# EasyEDA Pro project ProProject_stm32f103c8t6最小系统板_2024-05-02.epro

# Schematic Schematic1
Create Date: 2023-10-04; Page Name: P1; Project Name: stm32f103c8t6最小系统板; Schematic Name: Schematic1; Update Date: 2023-10-05; Company: 嘉立创EDA; Page Size: A4; Version: V1.0
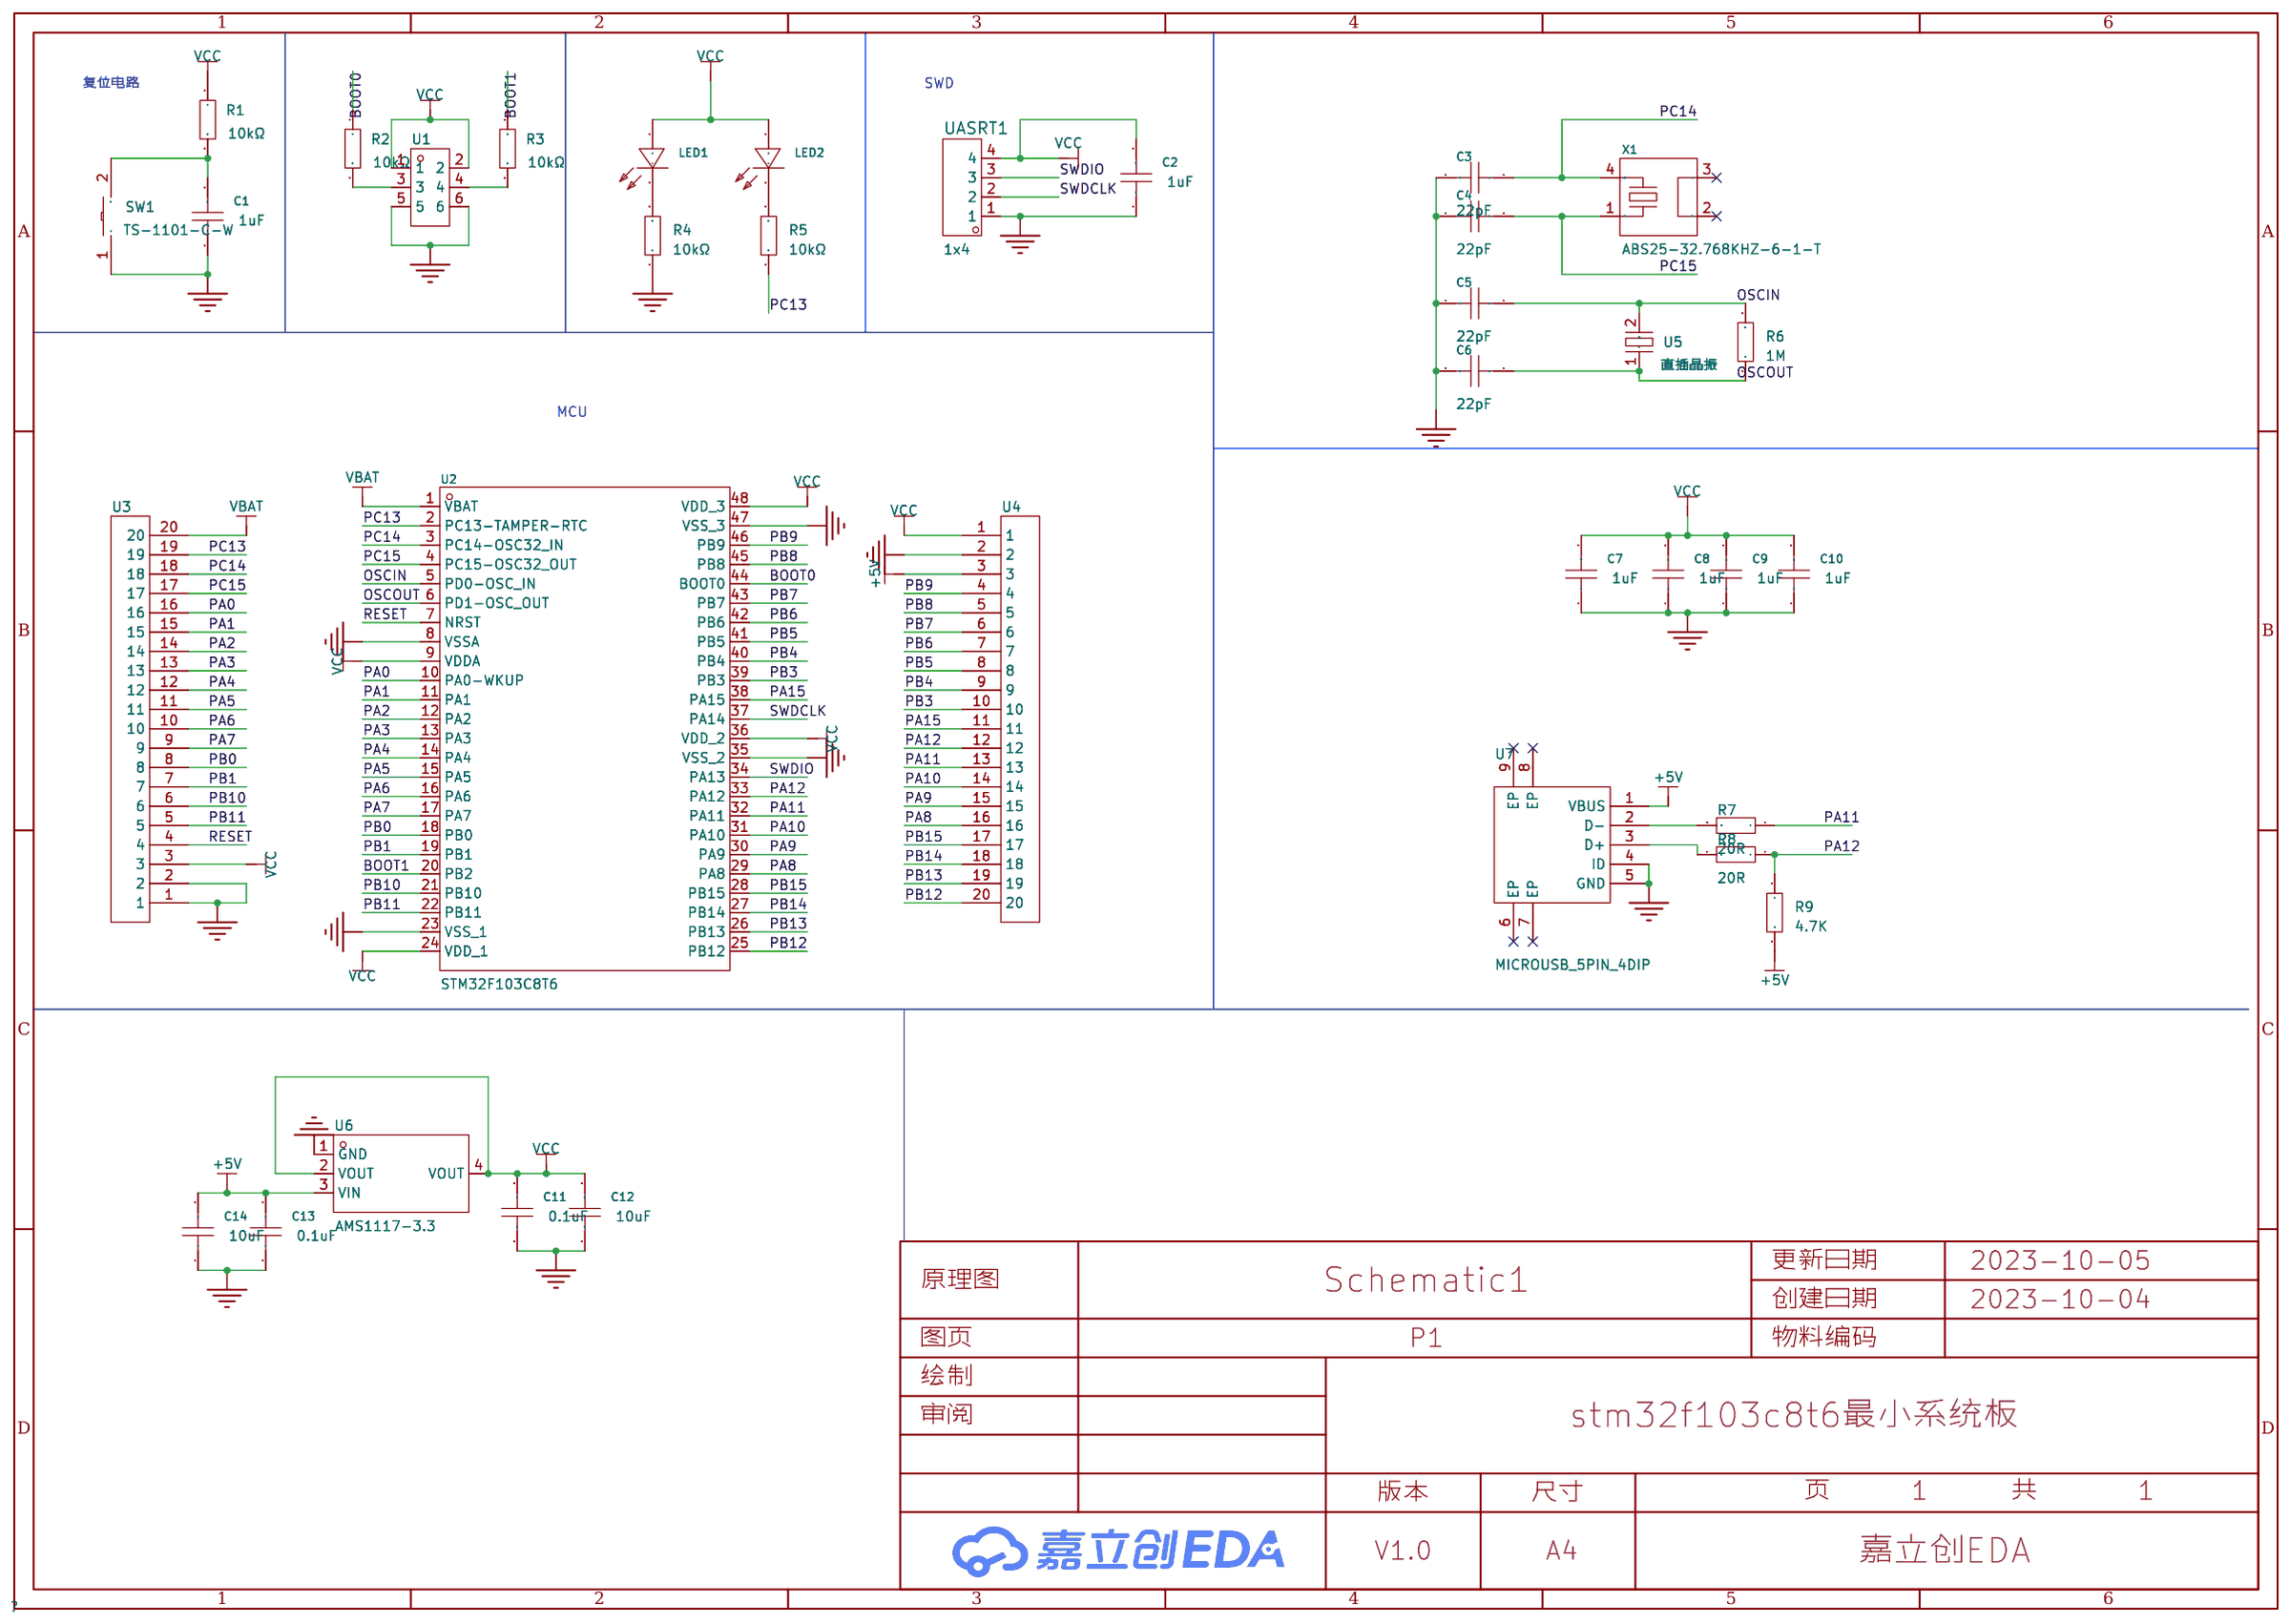
[diagram p0: schematic sheet]

## Parts
C1  1uF  [C0603]
C2  1uF  [C0603]
C3  22pF  [C0603]
C4  22pF  [C0603]
C5  22pF  [C0603]
C6  22pF  [C0603]
C7  1uF  [C0603]
C8  1uF  [C0603]
C9  1uF  [C0603]
C10  1uF  [C0603]
C11  0.1uF  [C0603]
C12  10uF  [C0603]
C13  0.1uF  [C0603]
C14  10uF  [C0603]
LED1  KT-0805G  [LED0805-R-RD]
LED2  KT-0805G  [LED0805-R-RD]
R1  10kΩ  [R0603]
R2  10kΩ  [R0603]
R3  10kΩ  [R0603]
R4  10kΩ  [R0603]
R5  10kΩ  [R0603]
R6  1M  [R0603]
R7  20R  [R0603]
R8  20R  [R0603]
R9  4.7K  [R0603]
SW1  TS-1101-C-W  [SW-SMD_L6.0-W3.3-LS8.0]
U1  2.54mm,2X3,短针针长3mm,长针针长6mm  [HDR-TH_6P-P2.54-V-M-R2-C3-S2.54-2]
U2  STM32F103C8T6  [LQFP-48_L7.0-W7.0-P0.50-LS9.0-BL]
U3  -  [HDR1X20]
U4  -  [HDR1X20]
U5  直插晶振  [HC-49S_L11.0-W4.7-P4.88]
U6  AMS1117-3.3  [SOT-223-3_L6.5-W3.4-P2.30-LS7.0-BR]
U7  MICROUSB_5PIN_4DIP  [MICRO-USB-SMD_U254-051N-4BH806]
UASRT1  1x4  [HDR-TH_4P-P2.54-V-M-1]
X1  ABS25-32.768KHZ-6-1-T  [SOJ-4_L8.4-W3.8-P5.5-BL]

## Library data of the parts
C1-C14 = TCC0603X5R475K250CT: 容值:4.7uF;额定电压:25V;材质(温度系数):X5R;; LCSC Part Name: 4.7uF 25V; Supplier Part: C5360844; Manufacturer: CCTC(三环); Supplier Footprint: 0603; Datasheet: https://atta.szlcsc.com/upload/public/pdf/source/20191203/C466239_F62A586702D44EEA1C39B32FC8662B21.pdf; Supplier: LCSC; Voltage Rated: 25V; Temperature Coefficient: X5R
LED1 LED2 = KT-0805G: 发光颜色:翠绿;二极管配置:-;透镜颜色:-;主波长:-;色温:-;光通量(25℃时):-;发光强度:-;功率:-;发光角度:-;安装方式:-;工作温度:-;; LCSC Part Name: 0805 翠绿 高亮; Supplier Part: C2297; Manufacturer: KENTO; Supplier Footprint: 0805; JLCPCB Part Class: 基础库; Datasheet: https://atta.szlcsc.com/upload/public/pdf/source/20170209/1486607340485.pdf; Supplier: LCSC; Emitted Color: 翠绿
R1-R9 = 0603WAF1002T5E: 电阻类型:厚膜电阻;阻值:10kΩ;精度:±1%;功率:100mW;; LCSC Part Name: 厚膜电阻 10kΩ ±1% 100mW; Supplier Part: C25804; Manufacturer: UNI-ROYAL(厚声); Supplier Footprint: 0603; JLCPCB Part Class: 基础库; Datasheet: https://atta.szlcsc.com/upload/public/pdf/source/20200306/C422600_1E6D84923E4A46A82E41ADD87F860B5C.pdf; Supplier: LCSC; Type: 厚膜电阻; Tolerance: ±1%; Power(Watts): 100mW; Temperature Coefficient: ±100ppm/℃; Overload Voltage (Max): 75V; Operating Temperature Range: -55℃~+155℃
SW1 = TS-1101-C-W: 触点电流:50mA;额定电压(AC):-;额定电压(DC):12V;额定功率:-;绝缘电阻:-;电路结构:单刀单掷;安装方式:立贴;带灯:无;作用力:260gf;机械寿命:5万次;带支架:否;; LCSC Part Name: 立贴 6*3.6*2.5mm 轻触开关 一型3*6*2.5有白ZD b拉伸白色带淡绿按键 卷装; Supplier Part: C318938; Manufacturer: XKB Connectivity(中国星坤); Supplier Footprint: SMD; JLCPCB Part Class: 扩展库; Datasheet: https://atta.szlcsc.com/upload/public/pdf/source/20200227/C318938_C2E53B1EEDE37D980A33616AC086DE53.pdf; Supplier: LCSC; Contact Current: 50mA; Voltage Rating (DC): 12V; Circuit: 单刀单掷; Mounting Style: 立贴; Actuator Style: 矩形按钮; Actuator/Cap Color: 白色带淡绿; With Lamp: 无; Operating Force: 260gf; Mechanical Life: 5万次; Operating Temperature: -30℃~+85℃; Switch Length: 6mm; Switch Width: 3.6mm; Switch Height: 2.5mm; Strike Gundam: 否
U1 = 2.54mm,2X3,短针针长3mm,长针针长6mm: Supplier Part: C9900024418; Supplier Footprint: 2X3; JLCPCB Part Class: 扩展库; Supplier: LCSC
U2 = STM32F103C8T6: CPU内核:ARM Cortex-M3;CPU最大主频:72MHz;工作电压范围:2V~3.6V;内部振荡器:有;程序 FLASH容量:64K@x8bit;RAM总容量:20KB;EEPROM/数据 FLASH容量:-;GPIO端口数量:37;ADC(单元数/通道数/位数):1@x10ch/12bit;外设/功能/协议栈:看门狗；DMA；看门狗；片载温度传感器;工作温度范围:-40℃~+85℃;; LCSC Part Name: ARM Cortex-M3 72MHz 闪存：64K@x8bit RAM：20KB MSL=3; Supplier Part: C8734; Manufacturer: ST(意法半导体); Supplier Footprint: LQFP-48(7x7); JLCPCB Part Class: 扩展库; Supplier: LCSC; CPU Core: ARM Cortex-M3; Maximum Frequency: 72MHz; Supply Voltage Range: 2V~3.6V; Internal Oscillator: 有; Program FLASH Size: 64K@x8bit; RAM Size: 20KB; GPIO Ports Number: 37; ADC (Units/Channels/bits): 1@x10ch/12bit; Peripherals / Functions / Protocol Stacks: 看门狗；DMA；看门狗；片载温度传感器; Operating Temperature Range: -40℃~+85℃
U3 U4 = 1X20
U5 = 直插晶振: Supplier Part: C9900021663; Supplier Footprint: 直插HC-49S; JLCPCB Part Class: 扩展库; Datasheet: https://atta.szlcsc.comnull; Supplier: LCSC
U6 = AMS1117-3.3_C6186: 输出类型:固定;输出极性:正;最大输入电压:-;输出电压:3.3V;输出电流:1A;电源纹波抑制比(PSRR):72dB@(120Hz);; LCSC Part Name: 输出3.3V 1A; Supplier Part: C6186; Manufacturer: AMS; Supplier Footprint: SOT-223; JLCPCB Part Class: 基础库; Datasheet: https://atta.szlcsc.com/upload/public/pdf/source/20180727/C6186_7A095716F0823C02F1997A905E26C086.pdf; Supplier: LCSC; Output Type: 固定; Output Polarity: 正; Number of Outputs: 1; Output Voltage: 3.3V; Dropout Voltage: 1.3V@(800mA); Output Current: 1A; Power Supply Rejection Ratio (PSRR): 72dB@(120Hz)
U7 = MICROUSB_5PIN_4DIP: Supplier Part: C9900010529; Supplier Footprint: USB_JACK; JLCPCB Part Class: 扩展库; Datasheet: https://atta.szlcsc.comnull; Supplier: LCSC
UASRT1 = 1x4: Supplier: LCSC; Manufacturer: ReliaPro; Manufacturer Part: Headers  Pins 1*4P; Supplier Part: C59481; JLCPCB Part Class: 扩展库
X1 = ABS25-32.768KHZ-6-1-T: Supplier Part: C5369037; Manufacturer: ABRACON; Supplier Footprint: SMD,3.8x8.4mm; JLCPCB Part Class: 扩展库; Datasheet: https://atta.szlcsc.com/upload/public/pdf/source/20210430/52A88B33D8D8DD9FFF4B1335EB6510DA.pdf; Supplier: LCSC

## Nets
+5V: C13.2 C14.2 R9.2 U4.3 U6.3(VIN) U7.1(VBUS)
GND: C1.1 C2.1 C3.2 C4.2 C5.2 C6.2 C7.1 C8.1 C9.1 C10.1 C11.1 C12.1 C13.1 C14.1 R4.1 SW1.1 U1.5 U1.6 U2.8(VSSA) U2.23(VSS_1) U2.35(VSS_2) U2.47(VSS_3) U3.1 U3.2 U4.2 U6.1(GND) U7.4(ID) U7.5(GND) UASRT1.1
VBAT: U2.1(VBAT) U3.20
VCC: C2.2 C7.2 C8.2 C9.2 C10.2 C11.2 C12.2 LED1.1(A) LED2.1(A) R1.1 U1.1 U1.2 U2.9(VDDA) U2.24(VDD_1) U2.36(VDD_2) U2.48(VDD_3) U3.3 U4.1 U6.2(VOUT) U6.4(VOUT) UASRT1.4
BOOT0: R2.1 U2.44(BOOT0)
BOOT1: R3.1 U2.20(PB2)
OSCIN: C5.1 R6.2 U2.5(PD0-OSC_IN) U5.2(GND)
OSCOUT: C6.1 R6.1 U2.6(PD1-OSC_OUT) U5.1
PA0: U2.10(PA0-WKUP) U3.16
PA1: U2.11(PA1) U3.15
PA2: U2.12(PA2) U3.14
PA3: U2.13(PA3) U3.13
PA4: U2.14(PA4) U3.12
PA5: U2.15(PA5) U3.11
PA6: U2.16(PA6) U3.10
PA7: U2.17(PA7) U3.9
PA8: U2.29(PA8) U4.16
PA9: U2.30(PA9) U4.15
PA10: U2.31(PA10) U4.14
PA11: R7.1 U2.32(PA11) U4.13
PA12: R8.1 R9.1 U2.33(PA12) U4.12
PA15: U2.38(PA15) U4.11
PB0: U2.18(PB0) U3.8
PB1: U2.19(PB1) U3.7
PB3: U2.39(PB3) U4.10
PB4: U2.40(PB4) U4.9
PB5: U2.41(PB5) U4.8
PB6: U2.42(PB6) U4.7
PB7: U2.43(PB7) U4.6
PB8: U2.45(PB8) U4.5
PB9: U2.46(PB9) U4.4
PB10: U2.21(PB10) U3.6
PB11: U2.22(PB11) U3.5
PB12: U2.25(PB12) U4.20
PB13: U2.26(PB13) U4.19
PB14: U2.27(PB14) U4.18
PB15: U2.28(PB15) U4.17
PC13: R5.1 U2.2(PC13-TAMPER-RTC) U3.19
PC14: C3.1 U2.3(PC14-OSC32_IN) U3.18 X1.4(GND)
PC15: C4.1 U2.4(PC15-OSC32_OUT) U3.17 X1.1
RESET: U2.7(NRST) U3.4
SWDCLK: U2.37(PA14) UASRT1.2
SWDIO: U2.34(PA13) UASRT1.3
$1N292: C1.2 R1.2 SW1.2
$1N842: R2.2 U1.3
$1N848: R3.2 U1.4
$1N1286: LED1.2(K) R4.2
$1N1428: LED2.2(K) R5.2
$1N8117: R7.2 U7.2(D-)
$1N8148: R8.2 U7.3(D+)

Not connected (* = marked no-connect by the designer): U7 6(EP)* 7(EP)* 8(EP)* 9(EP)*; X1 2(GND)* 3*

## Notes on the sheet
- 复位电路
- SWD
- MCU

# Board PCB1
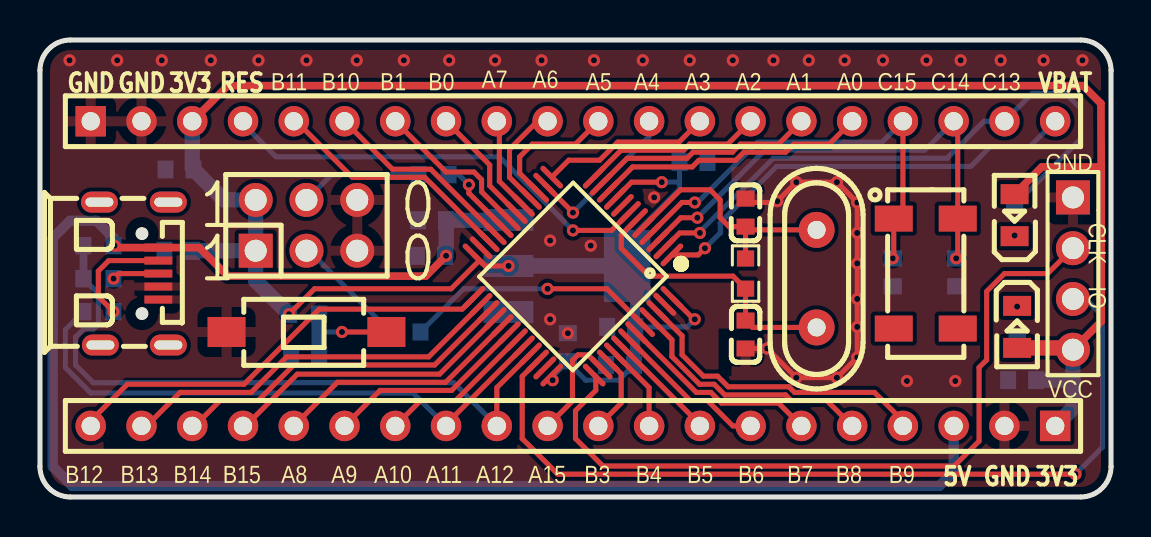
[diagram p1: board, top side]
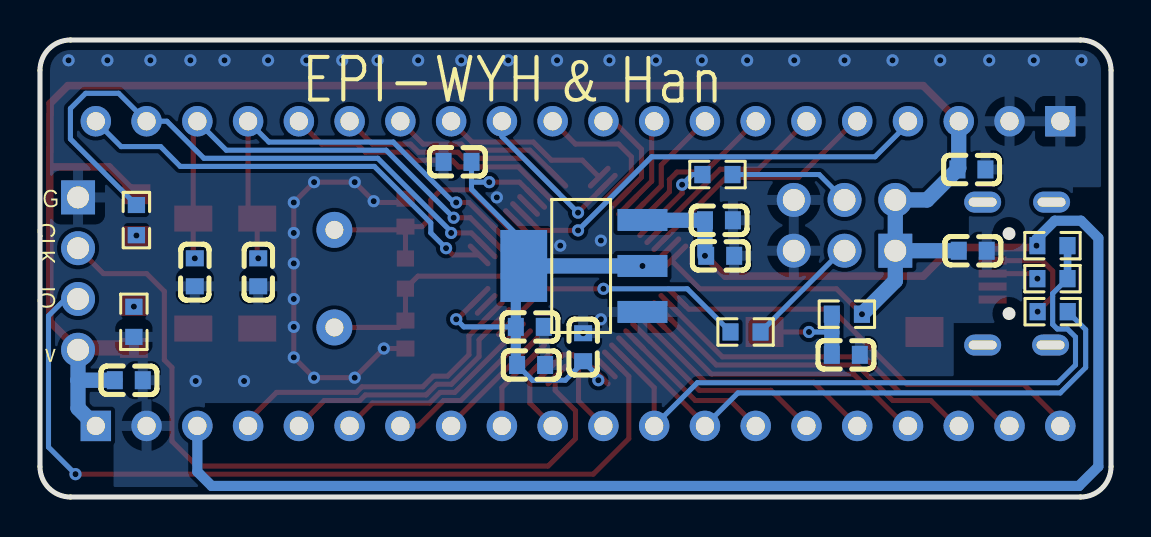
[diagram p2: board, bottom side, seen from below]

Outline 53.59 x 22.86 mm; copper layers: Top Layer, Bottom Layer. Coordinates in mm from the lower left corner of the outline.
Outline path: 0,21.34 0,1.52 arc(0.45,0.45) 1.52,0 52.07,0 arc(53.15,0.45) 53.59,1.52 53.59,21.34 arc(53.15,22.41) 52.07,22.86 1.52,22.86 arc(0.45,22.41) 0,21.34
Stack: Top Layer 0.035mm / Dielectric1 1.51mm FR4 er 4.5 / Bottom Layer 0.035mm

## Design rules (mm)
spacing safeClearance (default): track to track 0.152, other pairs 0.152 to 0.3
track width trackWidth (default): min 0.127, default 0.254, max 2.54
differential pair differentialPair (default): width min 0.127, default 0.254, max 2.54; gap min 0.152, default 0.152
via viaSize (default): diameter min 0.5, default 0.61, max 10; hole min 0.3, default 0.305, max 6
net GND uses copperRegion1

## Placement (name value [footprint] x y rotation side)
C1  1uF  [C0603]  13.27 7.11 0 bottom
C2  1uF  [C0603]  49.15 5.84 0 bottom
C3  22pF  [C0603]  45.85 11.24 270 bottom
C4  22pF  [C0603]  42.67 11.24 270 bottom
C5  22pF  [C0603]  35.31 14.22 90 top
C6  22pF  [C0603]  35.31 8.13 270 top
C7  1uF  [C0603]  6.98 16.38 0 bottom
C8  1uF  [C0603]  26.42 7.49 270 bottom
C9  1uF  [C0603]  32.7 16.76 180 bottom
C10  1uF  [C0603]  6.92 12.32 0 bottom
C11  0.1uF  [C0603]  29.02 6.6 0 bottom
C12  10uF  [C0603]  29.08 8.51 0 bottom
C13  0.1uF  [C0603]  19.62 13.84 0 bottom
C14  10uF  [C0603]  19.56 12.07 0 bottom
LED1  KT-0805G  [LED0805-R-RD]  48.89 8.51 270 top
LED2  KT-0805G  [LED0805-R-RD]  48.77 14.1 90 top
R1  10kΩ  [R0603]  13.22 9.14 0 bottom
R2  10kΩ  [R0603]  18.29 8.26 180 bottom
R3  10kΩ  [R0603]  19.69 16.13 180 bottom
R4  10kΩ  [R0603]  48.89 8.76 90 bottom
R5  10kΩ  [R0603]  48.77 13.85 270 bottom
R6  1M  [R0603]  35.31 11.18 90 top
R7  20R  [R0603]  2.92 9.27 0 bottom
R8  20R  [R0603]  2.93 10.92 0 bottom
R9  4.7K  [R0603]  2.93 12.57 0 bottom
SW1  TS-1101-C-W  [SW-SMD_L6.0-W3.3-LS8.0]  13.33 8.26 0 top
U1  2.54mm,2X3,短针针长3mm,长针针长6mm  [HDR-TH_6P-P2.54-V-M-R2-C3-S2.54-2]  13.33 13.59 0 top
U2  STM32F103C8T6  [LQFP-48_L7.0-W7.0-P0.50-LS9.0-BL]  26.67 11.05 135 top
U3  -  [HDR1X20]  26.67 18.8 0 top
U4  -  [HDR1X20]  26.67 3.56 180 top
U5  直插晶振  [HC-49S_L11.0-W4.7-P4.88]  38.86 10.92 90 top
U6  AMS1117-3.3  [SOT-223-3_L6.5-W3.4-P2.30-LS7.0-BR]  26.42 11.56 180 bottom
U7  MICROUSB_5PIN_4DIP  [MICRO-USB-SMD_U254-051N-4BH806]  4.7 11.18 270 top
UASRT1  1x4  [HDR-TH_4P-P2.54-V-M-1]  51.69 11.18 270 top
X1  ABS25-32.768KHZ-6-1-T  [SOJ-4_L8.4-W3.8-P5.5-BL]  44.32 11.18 270 top

## Footprints (pads in the part's own frame, mm; a bottom-side part is the same pattern mirrored in y, then rotated)
C0603
  rect 0.8x0.9 smd: 1(-0.7,0) 2(0.7,0)
HC-49S_L11.0-W4.7-P4.88
  round 1.8 hole 0.9: 1(-2.44,0) 2(2.44,0)
HDR1X20
  rect 1.524x1.524 hole 0.914: 1(-24.13,0)
  round 1.524 hole 0.914: 2(-21.59,0) 3(-19.05,0) 4(-16.51,0) 5(-13.97,0) 6(-11.43,0) 7(-8.89,0) 8(-6.35,0) 9(-3.81,0) 10(-1.27,0) 11(1.27,0) 12(3.81,0) 13(6.35,0) 14(8.89,0) 15(11.43,0) 16(13.97,0) 17(16.51,0) 18(19.05,0) 19(21.59,0) 20(24.13,0)
HDR-TH_4P-P2.54-V-M-1
  rect 1.7x1.7 hole 1.1: 1(-3.81,0)
  round 1.7 hole 1.1: 2(-1.27,0) 3(1.27,0) 4(3.81,0)
HDR-TH_6P-P2.54-V-M-R2-C3-S2.54-2
  rect 1.7x1.7 hole 1.1: 1(-2.54,-1.27)
  round 1.7 hole 1.1: 2(-2.54,1.27) 3(0,-1.27) 4(0,1.27) 5(2.54,-1.27) 6(2.54,1.27)
LED0805-R-RD
  rect 1x1.399 smd: 1(1.05,0) 2(-1.05,0)
LQFP-48_L7.0-W7.0-P0.50-LS9.0-BL
  oval 0.27x1.5 smd: 1(-2.75,-4.25) 2(-2.25,-4.25) 3(-1.75,-4.25) 4(-1.25,-4.25) 5(-0.75,-4.25) 6(-0.25,-4.25) 7(0.25,-4.25) 8(0.75,-4.25) 9(1.25,-4.25) 10(1.75,-4.25) 11(2.25,-4.25) 12(2.75,-4.25) 25(2.75,4.25) 26(2.25,4.25) 27(1.75,4.25) 28(1.25,4.25) 29(0.75,4.25) 30(0.25,4.25) 31(-0.25,4.25) 32(-0.75,4.25) 33(-1.25,4.25) 34(-1.75,4.25) 35(-2.25,4.25) 36(-2.75,4.25)
  oval 1.5x0.27 smd: 13(4.25,-2.75) 14(4.25,-2.25) 15(4.25,-1.75) 16(4.25,-1.25) 17(4.25,-0.75) 18(4.25,-0.25) 19(4.25,0.25) 20(4.25,0.75) 21(4.25,1.25) 22(4.25,1.75) 23(4.25,2.25) 24(4.25,2.75) 37(-4.25,2.75) 38(-4.25,2.25) 39(-4.25,1.75) 40(-4.25,1.25) 41(-4.25,0.75) 42(-4.25,0.25) 43(-4.25,-0.25) 44(-4.25,-0.75) 45(-4.25,-1.25) 46(-4.25,-1.75) 47(-4.25,-2.25) 48(-4.25,-2.75)
MICRO-USB-SMD_U254-051N-4BH806
  rect 0.4x1.4 smd: 1(-1.3,1.225) 2(-0.65,1.225) 3(0,1.225) 4(0.65,1.225) 5(1.3,1.225)
  oval 1.05x1.85 hole 0.45x1.4: 6(-3.575,1.725) 7(-3.575,-1.725) 8(3.575,1.725) 9(3.575,-1.675)
R0603
  rect 0.806x0.864 smd: 1(-0.753,0) 2(0.753,0)
SOJ-4_L8.4-W3.8-P5.5-BL
  rect 1.3x1.9 smd: 1(-2.75,-1.6) 2(2.75,-1.6) 3(2.75,1.6) 4(-2.75,1.6)
SOT-223-3_L6.5-W3.4-P2.30-LS7.0-BR
  rect 2.5x1.1 smd: 1(2.97,-2.3) 2(2.97,0) 3(2.97,2.3)
  rect 2.34x3.6 smd: 4(-2.97,0)
SW-SMD_L6.0-W3.3-LS8.0
  rect 1.9x1.5 smd: 1(-4,0) 2(4,0)

## Nets
As in the schematic.

Pads without a net: U7 6 7 8 9; X1 2 3

## Via types
v1: diameter 0.61, hole 0.305, Top Layer to Bottom Layer, 66 vias

## Routing (per net, layer and track width the routed paths; a pad name or vN(x,y) marks a point on that pad's centre or on a via; arc(x,y) is an arc through that point)
+5V: length 86.2
  Top Layer w0.381: v1(20.32,12.07) 19.3,11.05 9.4,11.05 7.97,12.48 U7.1 3.83,12.48 v1(3.73,12.57)
  Bottom Layer w0.508: v1(3.73,12.57) 3.73,12.91 2.82,13.82 1.5,13.82 0.64,12.95 0.64,1.52 1.61,0.55 45,0.55 45.72,1.27 U4.3
  Bottom Layer w0.762: U6.3 23.43,13.84 C13.2 v1(20.32,12.07)
GND: length 20.9
  Top Layer w0.254: C5.2 35.5,14.73 36.83,14.73 v1(36.89,14.8) v1(37.85,15.75) v1(39.88,15.75) v1(40.89,14.73) v1(40.89,13.21) v1(40.89,11.68) v1(40.89,9.91) v1(40.89,8.51) v1(40.89,6.98) v1(39.88,5.97) v1(37.85,5.97) v1(36.39,7.43) C6.2
  vias: v1(1.48,21.84) v1(3.87,21.84) v1(6.1,21.84) v1(8.55,21.84) v1(10.93,21.84) v1(13.33,21.84) v1(15.85,21.84) v1(18.21,21.84) v1(20.48,21.84) v1(22.77,21.84) v1(25.1,21.84) v1(25.53,12.83) v1(25.53,8.89) v1(26.42,8.19) v1(27.56,12.57) v1(27.72,21.84) v1(30.16,21.84) v1(30.73,14.99) v1(32.51,21.84) v1(34.67,21.84) v1(36.7,21.84) v1(38.47,21.84) v1(40.27,21.84) v1(42.18,21.84) v1(43.38,5.8) v1(44.36,21.84) v1(45.8,5.8) v1(46.07,21.84) v1(48.07,21.84) v1(50.22,21.84) v1(52.16,21.84)
VBAT: length 22.2
  Top Layer w0.254: v1(33.27,12.45) 32.94,12.11 U2.1
  Bottom Layer w0.254: U3.20 49.53,17.53 47.55,17.53 46.57,16.54 36.86,16.54 34.04,13.71 34.04,13.21 v1(33.27,12.45)
VCC: length 132.5
  Top Layer w0.254: v1(12.46,9.14) 13.73,10.41 20.57,10.41 21.99,11.83 ; U2.9 29.6,15.75 v1(31.11,15.75) ; U2.48 32.72,8.89 v1(32.77,8.89) ; v1(23.45,11.56) 22.27,11.56 U2.24
  Top Layer w0.381: U3.3 9.4,20.57 52.2,20.57 53.09,19.68 53.1,16.51 ; 53.1,16.51 50.13,16.51 LED2.1 ; 53.1,16.51 53.1,8.78 UASRT1.4
  Top Layer w0.762: LED1.1 51.6,7.46 UASRT1.4
  Bottom Layer w0.254: 29.34,11.61 29.34,12.73 32,15.4 32,15.76 ; v1(32.77,8.89) 32.39,8.51 C12.2 ; v1(25.65,5.84) 25.65,6.03 C8.2 26.42,6.73 27.3,5.84 28.96,5.84 C11.2 ; 32,15.76 31.99,15.75 v1(31.11,15.75) ; 32,15.76 C9.2
  Bottom Layer w0.508: C11.2 29.78,6.67 C12.2 29.78,11.16 U6.4
  Bottom Layer w0.762: 51.69,5.85 51.69,4.45 U4.1 ; 51.69,5.85 UASRT1.4 ; 51.69,5.85 51.69,5.84 C2.2 ; U1.1 U1.2 9.21,14.86 C7.2 7.62,16.45 U3.3 ; U1.1 C10.2 ; U1.1 10.8,10.81 v1(12.46,9.14) ; v1(23.45,11.56) U6.4
BOOT0: length 12.8
  Top Layer w0.254: U2.44 28.37,10.41 v1(25.4,10.41)
  Bottom Layer w0.254: R2.1 21.2,10.41 v1(25.4,10.41)
BOOT1: length 4
  Top Layer w0.254: v1(21.46,15.62) 21.46,15.2 U2.20
  Bottom Layer w0.254: 20.45,16.13 20.95,16.13 v1(21.46,15.62)
OSCIN: length 12.3
  Top Layer w0.254: 35.31,13.36 35.32,13.36 ; 35.31,13.36 C5.1 34.48,13.52 34.04,13.97 34.04,14.86 33.53,15.37 32.05,15.37 U2.5 ; 35.31,13.36 35.31,13.35 ; 35.32,13.36 35.31,13.35 ; 35.32,13.36 U5.2 ; 35.31,13.35 R6.2
OSCOUT: length 14.1
  Top Layer w0.254: U2.6 29.08,13.11 29.08,12.45 30.48,11.05 34.68,11.05 R6.1 C6.1 35.65,8.48 U5.1
PA0: length 13.7
  Top Layer w0.254: U2.10 29.66,16.51 32.64,16.51 32.97,16.84 34.81,16.84 35.22,17.25 37.31,17.25 37.72,17.65 39.5,17.65 U3.16
PA1: length 11.3
  Top Layer w0.254: 28.08,15.65 29.38,16.94 32.38,16.94 32.68,17.25 34.65,17.25 35.05,17.65 36.96,17.65 U3.15
PA2: length 9
  Top Layer w0.254: U2.12 29.08,17.35 32.21,17.35 32.51,17.65 34.42,17.65 U3.14
PA3: length 8.6
  Top Layer w0.254: U3.13 31.98,17.75 28.91,17.75 28.01,16.85 26.46,16.85 U2.13
PA4: length 8.2
  Top Layer w0.254: v1(26.67,14.22) 26.67,14.23 25.26,15.65
  Bottom Layer w0.254: v1(26.67,14.22) 30.48,18.03 U3.12
PA5: length 6.8
  Top Layer w0.254: U2.15 24,16.19 24,17.02 24.64,17.65 26.8,17.65 U3.11
PA6: length 5.4
  Top Layer w0.254: U2.16 23.49,15.99 23.49,17.4 24.89,18.8 U3.10
PA7: length 4.8
  Top Layer w0.254: 24.2,14.58 22.99,15.79 22.99,18.67 U3.9
PA8: length 12.5
  Top Layer w0.254: U2.29 20.3,5.74 14.88,5.74 U4.16
PA9: length 10.2
  Top Layer w0.254: U2.30 20.6,5.33 17.02,5.33 U4.15
PA10: length 7.8
  Top Layer w0.254: U2.31 20.8,4.83 19.05,4.83 U4.14
PA11: length 29
  Top Layer w0.254: 24.2,7.51 20.32,3.64 U4.13
  Bottom Layer w0.254: R7.1 1.27,8.37 1.27,6.48 2.54,5.21 18.67,5.21 U4.13
PA12: length 33.7
  Top Layer w0.254: U2.33 22.86,5.47 U4.12
  Bottom Layer w0.254: R8.1 2.92,10.18 2.92,8.64 2.69,8.41 2.18,8.41 1.78,8 1.78,6.6 2.67,5.72 20.7,5.72 U4.12
  Bottom Layer w0.381: R9.1 R8.1
PA15: length 5.6
  Top Layer w0.254: U2.38 27.42,7.11 26.92,7.11 26.64,6.83 26.64,4.8 U4.11
PB0: length 6
  Top Layer w0.254: 23.84,14.23 22.5,15.57 22.5,16.61 U3.8
PB1: length 8.1
  Top Layer w0.254: U3.7 20.32,16.26 21.72,16.26 22.1,15.88 22.1,15.27 U2.19
PB3: length 4
  Top Layer w0.254: U2.39 29.08,6.16 29.08,4.7 U4.10
PB4: length 4.3
  Top Layer w0.254: U2.40 30.48,5.47 U4.9
PB5: length 5.6
  Top Layer w0.254: 29.14,7.51 33.02,3.64 U4.8
PB6: length 7.8
  Top Layer w0.254: U4.7 34.67,3.56 33.4,4.83 32.54,4.83 U2.42
PB7: length 10.2
  Top Layer w0.254: U4.6 36.96,4.7 34.1,4.7 33.57,5.23 32.84,5.23 U2.43
PB8: length 12.8
  Top Layer w0.254: U4.5 39.37,4.83 37.59,4.83 37.31,5.11 34.27,5.11 33.74,5.64 33.01,5.64 31.62,7.02 31.62,7.86 30.56,8.93
PB9: length 15.3
  Top Layer w0.254: U4.4 43.18,3.81 41.76,5.23 37.76,5.23 37.48,5.51 34.44,5.51 33.91,6.05 33.2,6.05 32.13,7.11 32.13,8.06 U2.46
PB10: length 9.9
  Top Layer w0.254: 22.78,13.17 19.56,16.4 17.64,16.4 U3.6
PB11: length 12.2
  Top Layer w0.254: U2.22 19.26,15.99 15.63,15.99 12.83,18.8 U3.5
PB12: length 22
  Top Layer w0.254: U2.25 21.13,9.4 13.97,9.4 10.21,5.64 4.37,5.64 2.54,3.81 U4.20
PB13: length 19.5
  Top Layer w0.254: U4.19 5.33,3.56 7.01,5.23 10.57,5.23 12.34,7.01 19.45,7.01 22.07,9.64
PB14: length 17.2
  Top Layer w0.254: U4.18 7.75,3.56 9.02,4.83 10.92,4.83 12.7,6.6 19.75,6.6 U2.27
PB15: length 14.8
  Top Layer w0.254: U4.17 10.29,3.56 12.88,6.15 20,6.15 22.78,8.93
PC13: length 30.6
  Top Layer w0.254: v1(33.02,13.21) 32.01,13.21 U2.2
  Bottom Layer w0.254: R5.1 52.07,17.91 52.07,19.43 51.31,20.19 49.66,20.19 U3.19 47.24,18.8 45.39,16.94 36.69,16.94 33.02,13.27 v1(33.02,13.21)
PC14: length 24.3
  Top Layer w0.254: v1(45.85,11.94) 45.92,12.01 X1.4 45.92,18.59 U3.18 ; v1(32.89,13.97) 32.07,13.97 U2.3
  Bottom Layer w0.254: v1(32.89,13.97) 36.27,17.35 44.27,17.35 U3.18
PC15: length 22
  Top Layer w0.254: U3.17 43.18,14.38 X1.1 42.72,11.99 v1(42.67,11.94) ; v1(32.77,14.73) 32.12,14.73 30.56,13.17
  Bottom Layer w0.254: U3.17 42.14,17.75 35.92,17.75 32.89,14.73 v1(32.77,14.73)
RESET: length 22
  Top Layer w0.254: v1(26.67,13.34) 28.6,13.34 29.5,14.23
  Bottom Layer w0.254: v1(26.67,13.34) 22.99,17.02 11.81,17.02 10.16,18.67 U3.4
SWDCLK: length 37.8
  Top Layer w0.254: UASRT1.2 50.42,11.18 48.26,11.18 47.37,10.29 47.37,6.86 46.99,6.48 46.99,2.79 45.75,1.55 28.17,1.55 26.8,2.92 26.8,4.32 27.81,5.33 27.81,6.02 U2.37
SWDIO: length 42.9
  Top Layer w0.254: v1(51.82,1.14) 25.91,1.14 24.13,2.92 24.13,6.03 U2.34
  Bottom Layer w0.254: v1(51.82,1.14) 53.17,2.49 53.17,9.06 52.32,9.91 UASRT1.3
$1N292: length 5.4
  Top Layer w0.254: SW1.2 v1(15.11,8.26)
  Bottom Layer w0.254: v1(15.11,8.26) 14,8.26 13.97,8.23
  Bottom Layer w0.762: R1.2 C1.2
$1N842: length 5.9
  Bottom Layer w0.254: U1.3 13.47,12.32 R2.2
$1N848: length 6.1
  Bottom Layer w0.254: U1.4 14.61,16.13 R3.2
$1N1286:
  vias: v1(48.89,9.53)
$1N1428:
  vias: v1(48.77,13.08)
$1N8117: length 5.6
  Top Layer w0.254: U7.2 3.44,11.83 2.92,11.3 2.92,10.02 v1(3.67,9.27)
$1N8148: length 2.3
  Top Layer w0.254: U7.3 3.94,11.18 v1(3.68,10.92)

## Copper pours and planes (outline as drawn; the poured copper is in the pictures)
GND on Top Layer: -2.54,27.18 53.09,27.18 59.18,21.08 59.18,-4.44 59.82,-5.08 -3.56,-5.08 -3.81,-5.33 -3.81,20.83 -4.44,21.46 -2.14,23.34
GND on Bottom Layer: -2.03,26.92 56.13,26.92 58.42,24.64 58.42,-0.76 55.63,-3.56 -1.4,-3.56 -1.4,26.29

## Text on the board
Bottom Silkscreen Layer: Han | EPI-WYH | v | G | CLK | IO | &
Top Silkscreen Layer: GND | RES | 3V3 | VBAT | 5V | 1 | 0 | B12 | B13 | B14 | B15 | A8 | A9 | A10 | A11 | B0 | A12 | A7 | A15 | A6 | B3 | A5 | A4 | B4 | A3 | B5 | A2 | B6 | A1 | B7 | B8 | A0 | C15 | B9 | C14 | C13 | VCC | CLK | IO | B11 | B10 | B1
